# EAGLE design KMO_IO_MV5 (EAGLE 9.1.3)

## Sheet 1 of 2
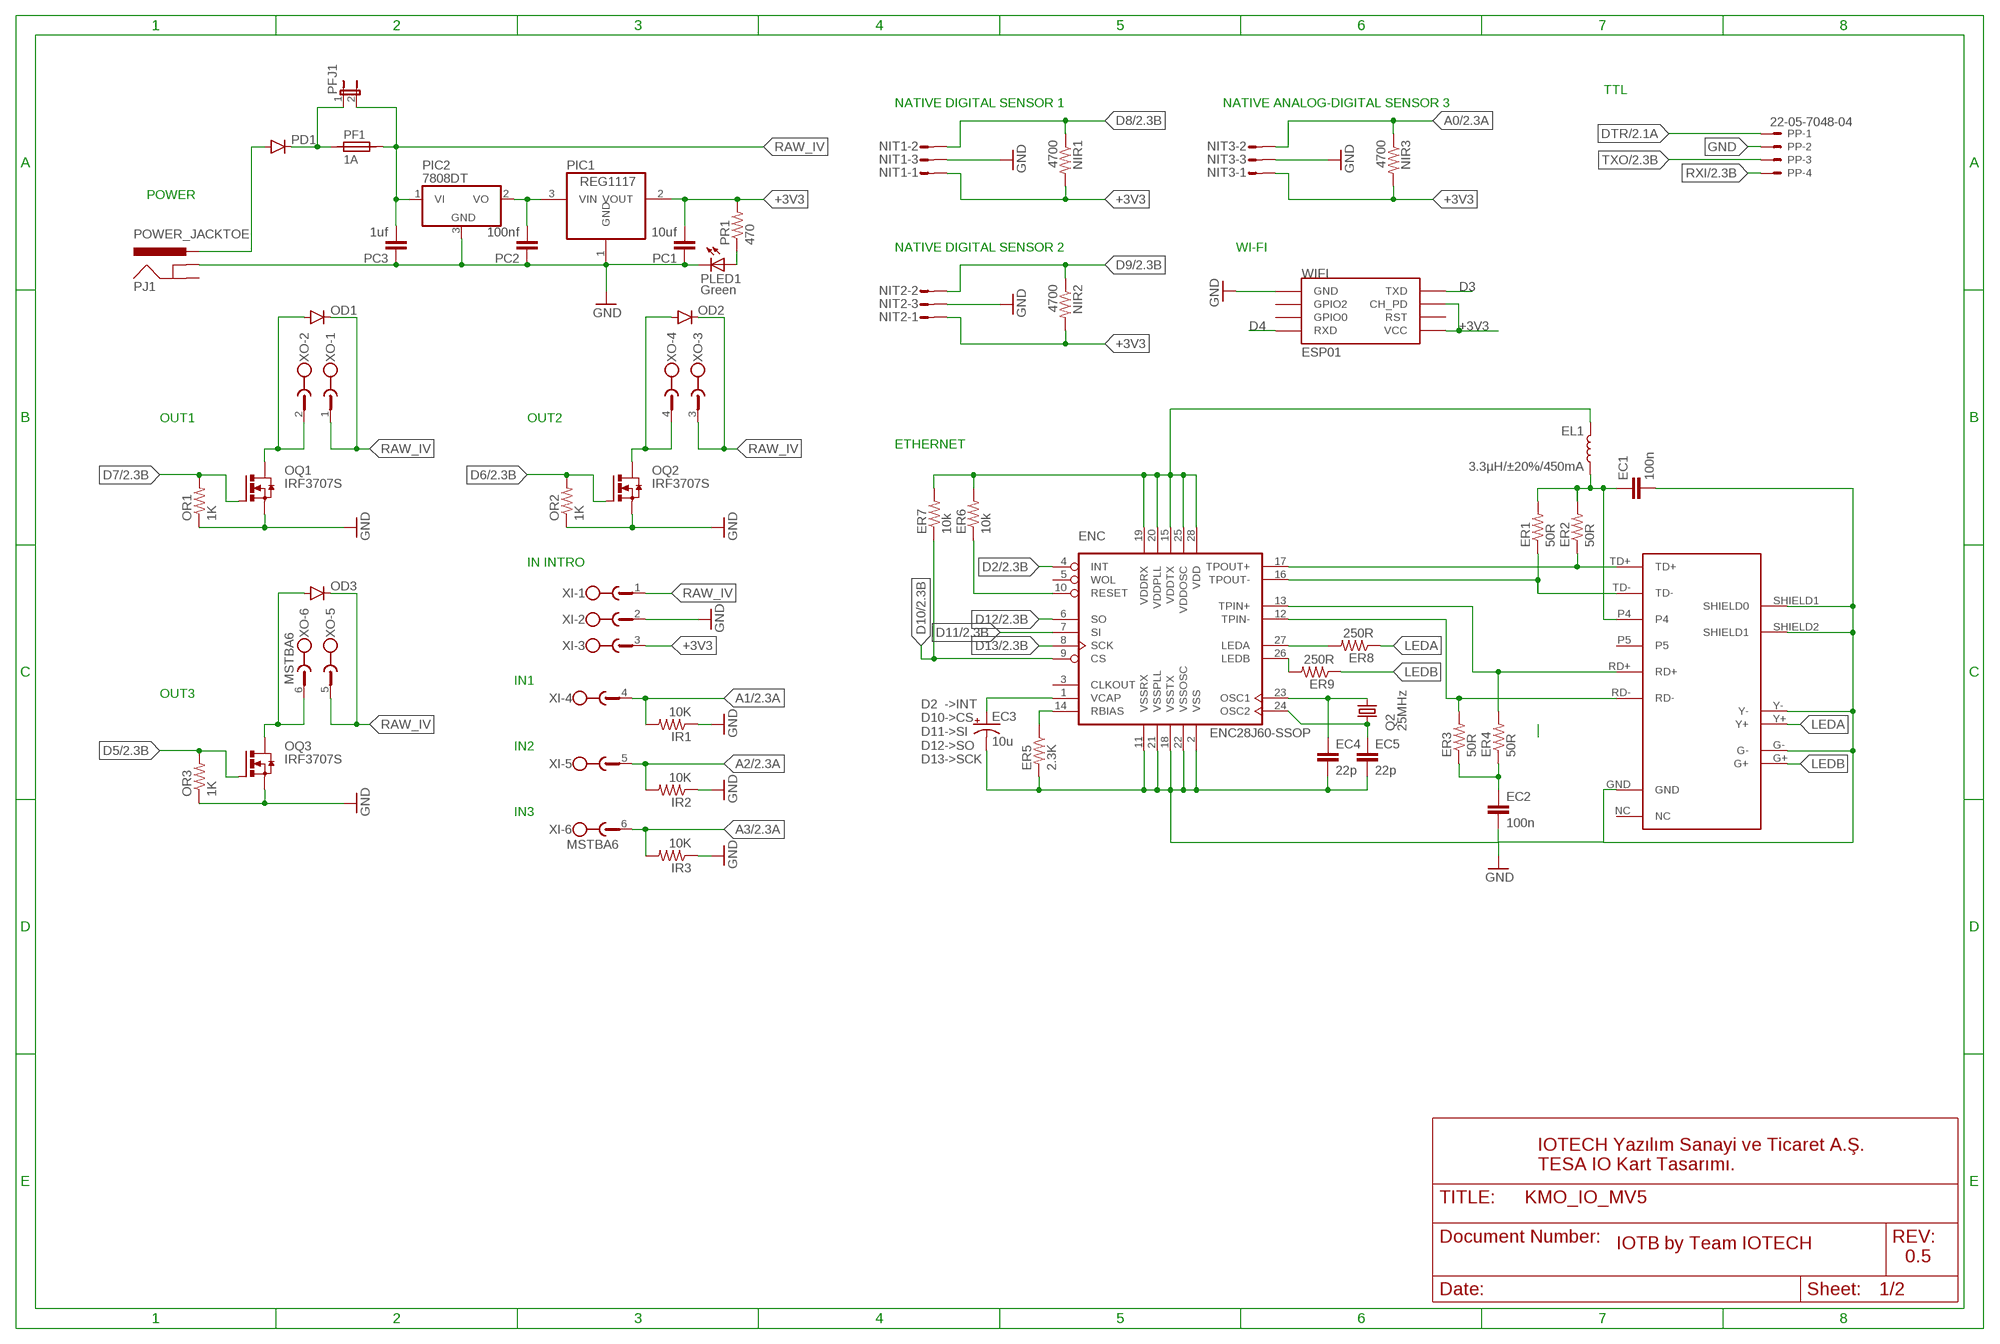
[diagram p0: schematic, sheet 1]

### Parts
EC1  100n  CAP0805  [0805]
EC2  100n  CAP0805  [0805]
EC3  10u  CAP_POL1206-KIT  [EIA3216-KIT]
EC4  22p  CAP0805  [0805]
EC5  22p  CAP0805  [0805]
EL1  3.3µH/±20%/450mA  INDUCTOR-0805-3.3UH  [0805]
ENC  ENC28J60-SSOP  [SSOP28]
ER1  50R  RESISTOR0805-RES  [0805]
ER2  50R  RESISTOR0805-RES  [0805]
ER3  50R  RESISTOR0805-RES  [0805]
ER4  50R  RESISTOR0805-RES  [0805]
ER5  2.3K  RESISTOR0805-RES  [0805]
ER6  10k  RESISTOR0805-RES  [0805]
ER7  10k  RESISTOR0805-RES  [0805]
ER8  250R  RESISTOR0805-RES  [0805]
ER9  250R  RESISTOR0805-RES  [0805]
IR1  10K  RESISTOR0805-RES  [0805]
IR2  10K  RESISTOR0805-RES  [0805]
IR3  10K  RESISTOR0805-RES  [0805]
NIR1  4700  RESISTOR0805-RES  [0805]
NIR2  4700  RESISTOR0805-RES  [0805]
NIR3  4700  RESISTOR0805-RES  [0805]
NIT1  S03P  [S03P]
NIT2  S03P  [S03P]
NIT3  S03P  [S03P]
OD1  DIODESMA  [SMA-DIODE]
OD2  DIODESMA  [SMA-DIODE]
OD3  DIODESMA  [SMA-DIODE]
OQ1  IRF3707S  IRF3704S  [D2PACK]
OQ2  IRF3707S  IRF3704S  [D2PACK]
OQ3  IRF3707S  IRF3704S  [D2PACK]
OR1  1K  RESISTOR0805-RES  [0805]
OR2  1K  RESISTOR0805-RES  [0805]
OR3  1K  RESISTOR0805-RES  [0805]
PC1  10uf  CAP0805  [0805]
PC2  100nf  CAP0805  [0805]
PC3  1uf  CAP0805  [0805]
PD1  DIODESMA  [SMA-DIODE]
PF1  1A  SIBA194600  [1820]
PFJ1  JP1E  [JP1]
PIC1  REG1117  [SOT223]
PIC2  7808DT  [TO252]
PJ1  POWER_JACKTOE  [POWER_JACK_SMD_OVERPASTE_TOE]
PLED1  Green  LEDCHIP-LED0805  [CHIP-LED0805]
PP  22-05-7048-04  [7395-04]
PR1  470  RESISTOR0805-RES  [0805]
Q2  25MHz  KX-9B  [5.0X3.2_2]
U$2  HR911105A  [RJ45]
WIFI  ESP01  [ESP01]
XI  MSTBA6  [MSTBA6]
XO  MSTBA6  [MSTBA6]

### Nets
+3V3: EL1.1 ENC.15(VDDTX) ENC.19(VDDRX) ENC.20(VDDPLL) ENC.25(VDDOSC) ENC.28(VDD) ER6.2 ER7.2 NIR1.2 NIR2.2 NIR3.2 NIT1.1 NIT2.1 NIT3.1 PC1.2 PIC1.2(VOUT) PR1.2 WIFI.CH_PD WIFI.VCC XI.3 ; also sheet 2
A0: NIR3.1 NIT3.2 ; also sheet 2
A1: IR1.2 XI.4 ; also sheet 2
A2: IR2.2 XI.5 ; also sheet 2
A3: IR3.2 XI.6 ; also sheet 2
D2: ENC.4(INT) ; also sheet 2
D3: WIFI.TX(TXD) ; also sheet 2
D4: WIFI.RX(RXD) ; also sheet 2
D5: OQ3.1(G) OR3.2 ; also sheet 2
D6: OQ2.1(G) OR2.2 ; also sheet 2
D7: OQ1.1(G) OR1.2 ; also sheet 2
D8: NIR1.1 NIT1.2 ; also sheet 2
D9: NIR2.1 NIT2.2 ; also sheet 2
D10: ENC.9(CS) ER7.1 ; also sheet 2
D11: ENC.7(SI) ; also sheet 2
D12: ENC.6(SO) ; also sheet 2
D13: ENC.8(SCK) ; also sheet 2
DTR: PP.1 ; also sheet 2
EP4: EC1.1 EL1.2 ER1.2 ER2.2 U$2.P4
GND: EC1.2 EC2.2 EC3.C(-) EC4.2 EC5.2 ENC.2(VSS) ENC.11(VSSRX) ENC.18(VSSTX) ENC.21(VSSPLL) ENC.22(VSSOSC) ER5.2 IR1.1 IR2.1 IR3.1 NIT1.3 NIT2.3 NIT3.3 OQ1.3(S) OQ2.3(S) OQ3.3(S) OR1.1 OR2.1 OR3.1 PC1.1 PC2.1 PC3.1 PIC1.1(GND) PIC2.3(GND) PJ1.GND(GNDBREAK) PLED1.C PP.2 U$2.G- U$2.GND U$2.SHIELD1(SHIELD0) U$2.SHIELD2(SHIELD1) U$2.Y- WIFI.GND XI.2 ; also sheet 2
LEDA: ER8.1 U$2.Y+
LEDB: ER9.1 U$2.G+
N$1: OD3.A OQ3.2(D) XO.6
N$2: PD1.C PF1.1 PFJ1.1
N$3: OD1.A OQ1.2(D) XO.2
N$4: OD2.A OQ2.2(D) XO.4
N$6: EC2.1 ER3.1 ER4.1
N$7: PD1.A PJ1.VIN0(PWR)
N$9: ENC.27(LEDA) ER8.2
N$11: PLED1.A PR1.1
N$12: PC2.2 PIC1.3(VIN) PIC2.2(VO)
N$13: EC3.A(+) ENC.1(VCAP)
N$14: ENC.26(LEDB) ER9.2
N$17: ENC.10(RESET) ER6.1
N$19: ENC.14(RBIAS) ER5.1
N$22: EC5.1 ENC.24(OSC2) Q2.1
N$24: EC4.1 ENC.23(OSC1) Q2.2
RAW_IV [vcc]: OD1.C OD2.C OD3.C PC3.2 PF1.2 PFJ1.2 PIC2.1(VI) XI.1 XO.1 XO.3 XO.5
RD+: ENC.13(TPIN+) ER4.2 U$2.RD+
RD-: ENC.12(TPIN-) ER3.2 U$2.RD-
RXI: PP.4 ; also sheet 2
TD+: ENC.17(TPOUT+) ER2.1 U$2.TD+
TD-: ENC.16(TPOUT-) ER1.1 U$2.TD-
TXO: PP.3 ; also sheet 2
Unconnected: ENC.3(CLKOUT) ENC.5(WOL) PJ1.P$4(GND) U$2.NC U$2.P5 WIFI.GPIO0 WIFI.GPIO2 WIFI.RST

### Notes on the sheet
- TTL
- NATIVE DIGITAL SENSOR 1 | NATIVE ANALOG-DIGITAL SENSOR 3
- POWER
- NATIVE DIGITAL SENSOR 2 | WI-FI
- OUT1 | OUT2
- ETHERNET
- IN INTRO
- IN1
- OUT3
- IN2
- D2  ->INT
  D10->CS
  D11->SI
  D12->SO
  D13->SCK
- IN3
- IOTECH Yazılım Sanayi ve Ticaret A.Ş.
  TESA IO Kart Tasarımı.
- IOTB by Team IOTECH
- 0.5

## Sheet 2 of 2
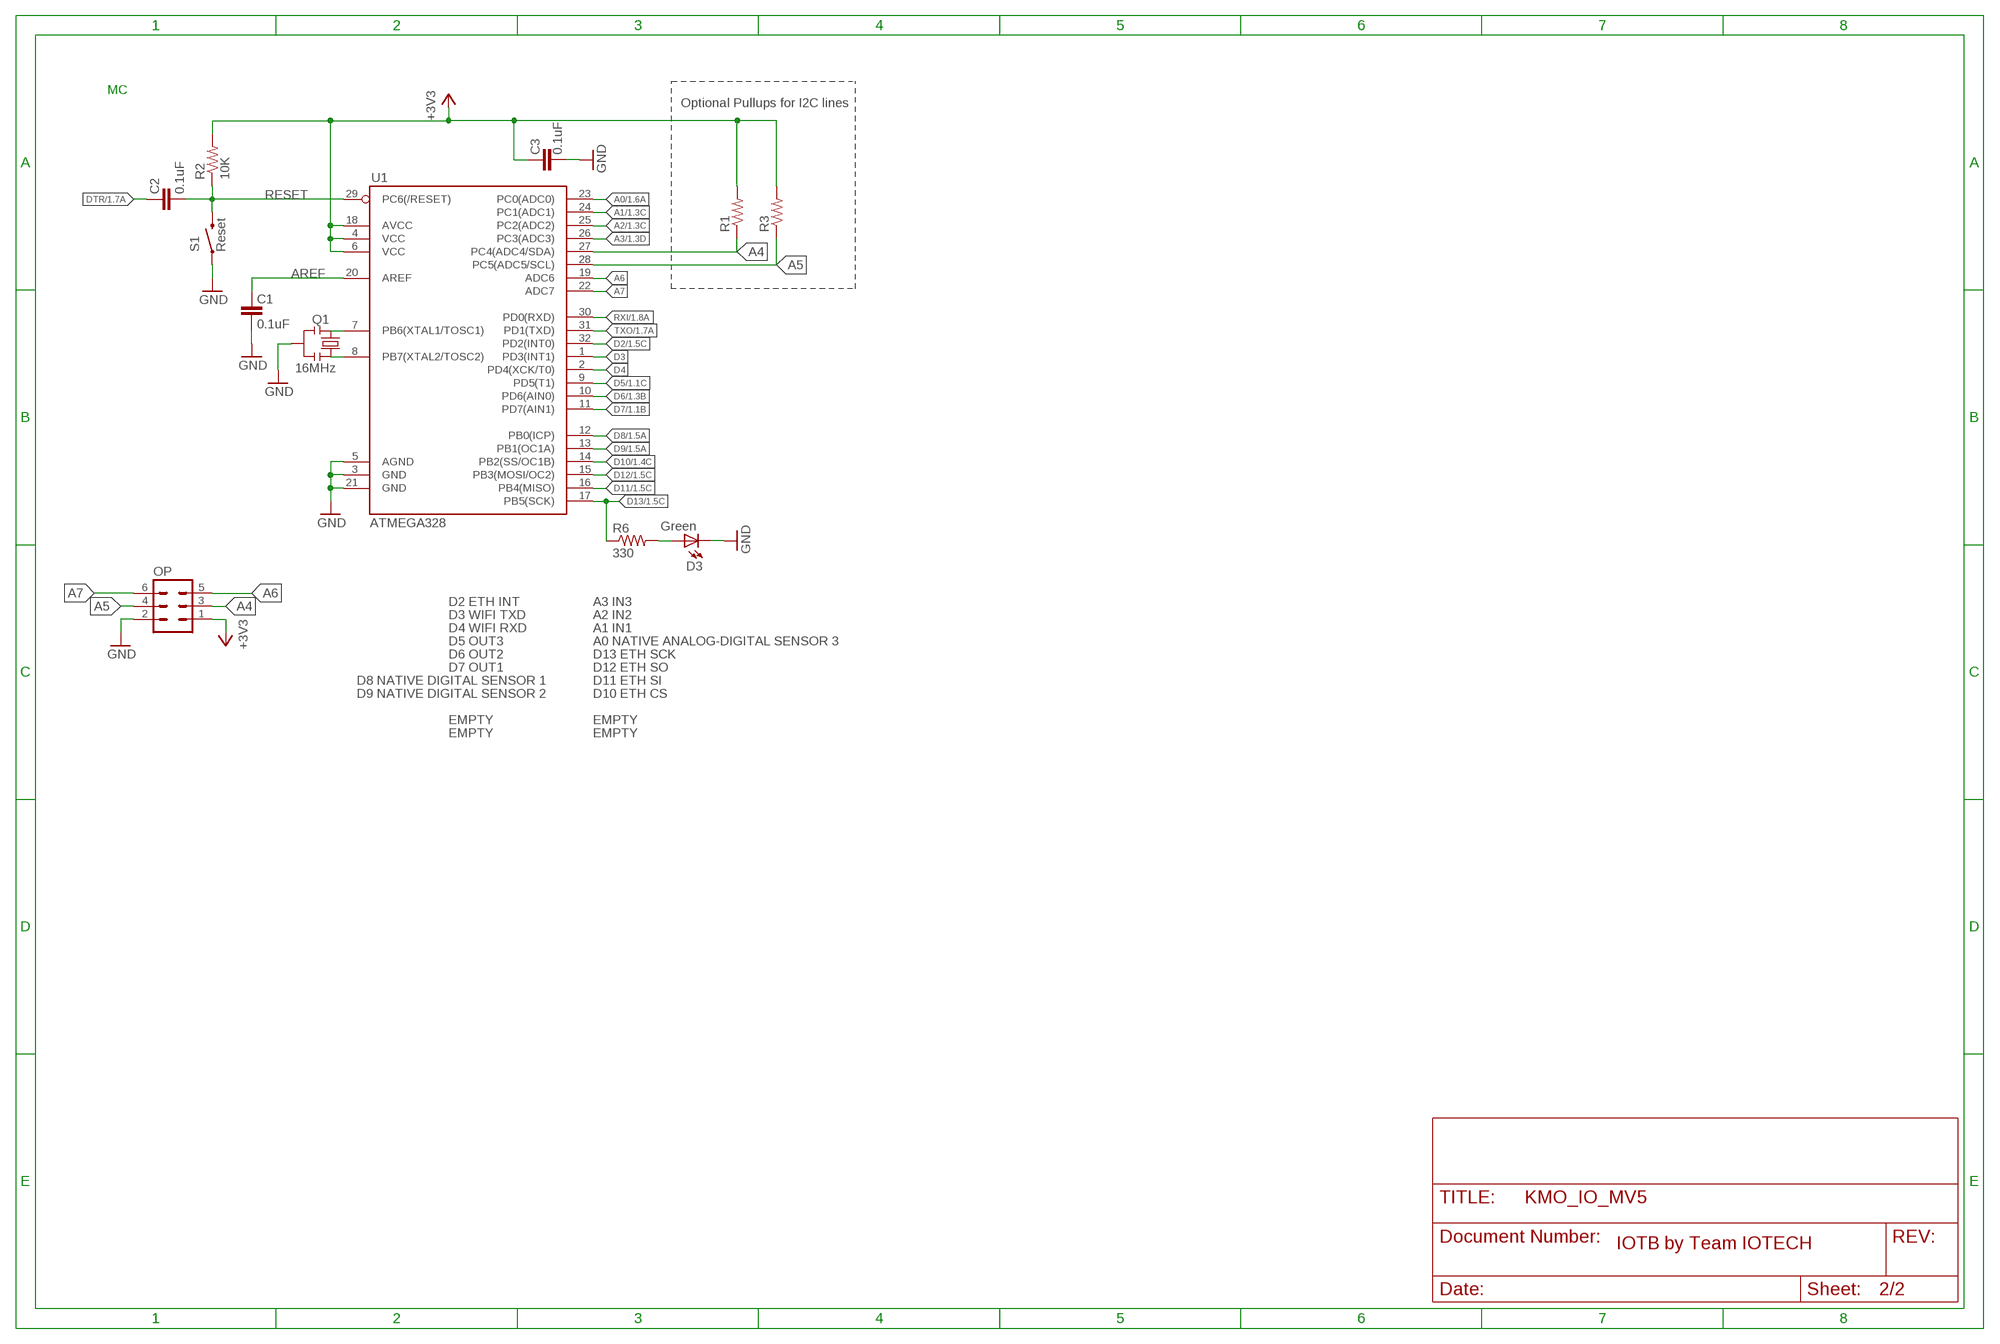
[diagram p1: schematic, sheet 2]

### Parts
C1  0.1uF  CAP0805  [0805]
C2  0.1uF  CAP0805  [0805]
C3  0.1uF  CAP0805  [0805]
D3  Green  LEDCHIP-LED0805  [CHIP-LED0805]
OP  MA03-2  [MA03-2]
Q1  16MHz  RESONATOR1:1  [RESONATOR-SMD-1:1]
R1  RESISTOR0805-RES  [0805]
R2  10K  RESISTOR0805-RES  [0805]
R3  RESISTOR0805-RES  [0805]
R6  330  RESISTOR0805-RES  [0805]
S1  Reset  SWITCH-MOMENTARY-2SMD-ALT01  [TACTILE-SWITCH-SMD-ALT01]
U1  ATMEGA328  ATMEGA168  [TQFP32-08]

### Nets
+3V3: C3.2 OP.1 R1.2 R2.2 R3.2 U1.4(VCC) U1.6(VCC) U1.18(AVCC) ; also sheet 1
A0: U1.23(PC0(ADC0)) ; also sheet 1
A1: U1.24(PC1(ADC1)) ; also sheet 1
A2: U1.25(PC2(ADC2)) ; also sheet 1
A3: U1.26(PC3(ADC3)) ; also sheet 1
A4: OP.3 R1.1 U1.27(PC4(ADC4/SDA))
A5: OP.4 R3.1 U1.28(PC5(ADC5/SCL))
A6: OP.5 U1.19(ADC6)
A7: OP.6 U1.22(ADC7)
AREF: C1.2 U1.20(AREF)
D2: U1.32(PD2(INT0)) ; also sheet 1
D3: U1.1(PD3(INT1)) ; also sheet 1
D4: U1.2(PD4(XCK/T0)) ; also sheet 1
D5: U1.9(PD5(T1)) ; also sheet 1
D6: U1.10(PD6(AIN0)) ; also sheet 1
D7: U1.11(PD7(AIN1)) ; also sheet 1
D8: U1.12(PB0(ICP)) ; also sheet 1
D9: U1.13(PB1(OC1A)) ; also sheet 1
D10: U1.14(PB2(SS/OC1B)) ; also sheet 1
D11: U1.16(PB4(MISO)) ; also sheet 1
D12: U1.15(PB3(MOSI/OC2)) ; also sheet 1
D13: R6.1 U1.17(PB5(SCK)) ; also sheet 1
DTR: C2.2 ; also sheet 1
GND: C1.1 C3.1 D3.C OP.2 Q1.2 S1.1 S1.2 U1.3(GND) U1.5(AGND) U1.21(GND) ; also sheet 1
N$5: D3.A R6.2
N$10: Q1.3 U1.8(PB7(XTAL2/TOSC2))
N$15: Q1.1 U1.7(PB6(XTAL1/TOSC1))
RESET: C2.1 R2.1 S1.3 S1.4 U1.29(PC6(/RESET))
RXI: U1.30(PD0(RXD)) ; also sheet 1
TXO: U1.31(PD1(TXD)) ; also sheet 1

### Notes on the sheet
- MC
- Optional Pullups for I2C lines
- D2 ETH INT | A3 IN3
- D3 WIFI TXD | A2 IN2
- D4 WIFI RXD | A1 IN1
- D5 OUT3 | A0 NATIVE ANALOG-DIGITAL SENSOR 3
- D6 OUT2 | D13 ETH SCK
- D7 OUT1 | D12 ETH SO
- D8 NATIVE DIGITAL SENSOR 1 | D11 ETH SI
- D9 NATIVE DIGITAL SENSOR 2 | D10 ETH CS
- EMPTY | EMPTY
- EMPTY | EMPTY
- IOTB by Team IOTECH

## Library data of the parts
C1-C3 EC1 EC2 EC4 EC5 = SparkFun-Passives:CAP: Capacitor Standard 0603 ceramic capacitor, and 0.1" leaded capacitor.
D3 PLED1 = led:LED: LED OSRAM: - CHIPLED LG R971, LG N971, LY N971, LG Q971, LY Q971, LO R971, LY R971 LH N974, LH R974 LS Q976, LO Q976, LY Q976 LO Q996 - Hyper CHIPLED LW Q18S LB Q993, LB Q99A, LB R99A - SideLED LS A670, LO A670, LY A670, LG A670, LP A670 LB A673, LV A673, LT A673, LW A673 LH A674 LY A675 LS A676, LA A676, LO A676, LY A676, LW A676 LS A679, LY A679, LG A679 - Hyper Micro SIDELED® LS Y876, LA Y876, LO Y876, LY Y876 LT Y87S - SmartLED LW L88C, LW L88S LB L89C, LB L89S, LG L890 LS L89K, LO L89K, LY L89K LS L896, LA L896, LO L896, LY L896 - TOPLED LS T670, LO T670, LY T670, LG T670, LP T670 LSG T670, LSP T670, LSY T670, LOP T670, LYG T670 LG T671, LOG T671, LSG T671 LB T673, LV T673, LT T673, LW T673 LH T674 LS T676, LA T676, LO T676, LY T676, LB T676, LH T676, LSB T676, LW T676 LB T67C, LV T67C, LT T67C, LS T67K, LO T67K, LY T67K, LW E67C LS E67B, LA E67B, LO E67B, LY E67B, LB E67C, LV E67C, LT E67C LW T67C LS T679, LY T679, LG T679 LS T770, LO T770, LY T770, LG T770, LP T770 LB T773, LV T773, LT T773, LW T773 LH T774 LS E675, LA E675, LY E675, LS T675 LS T776, LA T776, LO T776, LY T776, LB T776 LHGB T686 LT T68C, LB T68C - Hyper Mini TOPLED® LB M676 - Mini TOPLED Santana® LG M470 LS M47K, LO M47K, LY M47K Source: http://www.osram.convergy.de LUXEON: - LUMILED® LXK2-PW12-R00, LXK2-PW12-S00, LXK2-PW14-U00, LXK2-PW14-V00 LXK2-PM12-R00, LXK2-PM12-S00, LXK2-PM14-U00 LXK2-PE12-Q00, LXK2-PE12-R00, LXK2-PE12-S00, LXK2-PE14-T00, LXK2-PE14-U00 LXK2-PB12-K00, LXK2-PB12-L00, LXK2-PB12-M00, LXK2-PB14-N00, LXK2-PB14-P00, LXK2-PB14-Q00 LXK2-PR12-L00, LXK2-PR12-M00, LXK2-PR14-Q00, LXK2-PR14-R00 LXK2-PD12-Q00, LXK2-PD12-R00, LXK2-PD12-S00 LXK2-PH12-R00, LXK2-PH12-S00 LXK2-PL12-P00, LXK2-PL12-Q00, LXK2-PL12-R00 Source: www.luxeon.com KINGBRIGHT: KA-3528ASYC Source: www.kingbright.com
EC3 = SparkFun-Passives:CAP_POL: Capacitor Polarized These are standard SMD and PTH capacitors. Normally 10uF, 47uF, and 100uF in electrolytic and tantalum varieties. Always verify the external diameter of the through hole cap, it varies with capacity, voltage, and manufacturer. The EIA devices should be standard.
EL1 = SparkFun-Coils:INDUCTOR: Inductors Resist changes in electrical current. Basically a coil of wire. SparkFun Products: SparkFun Load Cell Amplifier - HX711 <https://www.sparkfun.com/products/13879> IOIO-OTG - V2.2 <https://www.sparkfun.com/products/13613>; PROD_ID: NDUC-13076
ENC = microchip-enc28j60:ENC28J60-*: Microchip 10Mbit Eth. contoller with SPI interface
ER1-ER9 IR1-IR3 NIR1-NIR3 OR1-OR3 PR1 R1-R3 R6 = SparkFun-Passives:RESISTOR: Resistor Basic schematic elements and footprints for 0603, 1206, and PTH resistors.
NIT1-NIT3 = con-amp-mt:S03P: AMP MT CONNECTOR; OC_FARNELL: unknown; OC_NEWARK: unknown
OD1-OD3 PD1 = SparkFun-DiscreteSemi:DIODE: Diode These are standard reverse protection diodes and small signal diodes. SMA package can handle up to about 1A. SOD-323 can handle about 200mA. What the SOD-323 package when ordering, there are some mfgs out there that are 5-pin packages.
OP = con-lstb:MA03-2: PIN HEADER; OC_FARNELL: unknown; OC_NEWARK: unknown
OQ1-OQ3 = transistor-power:IRF3704: SMPS MOSFET HEXFET® Power MOSFET Source: http://www.irf.com/product-info/datasheets/data/irf3704.pdf
PC1-PC3 = SparkFun-Capacitors:CAP: Capacitor Standard 0603 ceramic capacitor, and 0.1" leaded capacitor.
PF1 = _hhn_PtcFuses_Siba_r500_Ozan:SIBA194600*: SIBA PTC-Fuses, Series 194600, 1812 (4.5 3.2)mm Source: www.siba.de/ Package: SMD 1812 (4.5 x 3.2)mm Technologies: SIBA194600Axxx xxx: Trip-Current * 10 mA Author: Dipl.-Ing. FH Rainer Bayer
PFJ1 = jumper:JP1E: JUMPER
PIC1 = burr-brown:REG1117: 800mA and 1A Low Dropout (LDO) Positive Regulator 1.8V, 2.5V, 2.85V, 3.3V, 5V, and Adj; MPN: REG1117; OC_FARNELL: 1097566; OC_NEWARK: 14P6981
PIC2 = linear:78*: Positive VOLTAGE REGULATOR Source: http://cache.national.com/ds/LM/LM78L05.pdf http://www.fairchildsemi.com/ds/LM/LM7805.pdf
PJ1 = SparkFun-Connectors:POWER_JACK: Power Jack Connector This is the standard 5.5mm barrel jack for power. The PTH is the most common, proven, reliable, footprint. The Slot footprint only works if the mill layer is transmitted to the PCB fab house so be warned. Here are the connectors we sell at SparkFun: DC Barrel Power Jack/Connector <https://www.sparkfun.com/products/119> (PRT-00119) DC Barrel Power Jack/Connector (SMD) <https://www.sparkfun.com/products/12748> (PRT-12748) DC Barrel Jack Adapter - Breadboard Compatible <https://www.sparkfun.com/products/10811> (PRT-10811) It is used on this SparkFun product (and many, many others): SparkFun RedBoard - Programmed with Arduino <https://www.sparkfun.com/products/12757> (DEV-12757) Also, if you need a mating power supply or connector, please check these out: Wall Adapter Power Supply - 9VDC 650mA <https://www.sparkfun.com/products/298> (TOL-00298) DC Barrel Jack Adapter - Male <https://www.sparkfun.com/products/10287> (PRT-10287); PROD_ID: CONN-08106; SF_ID: PRT-12748
PP = con-molex:22-?-04: CONNECTOR wire to board 2.54 mm (.1 inch) pitch header; MF: MOLEX; OC_FARNELL: unknown; OC_NEWARK: unknown
Q1 = Testing:RESONATOR: Resonator Small SMD resonator. This is the itty bitty 10/20MHz resonators with built in caps. CSTCE10M0G55 and CSTCE20M0V53. Footprint for SMD has been used in SFE production for years, and does work okay. 1:1 is an attempt to get larger fillets on the sides so it will be easier to inspect these solders in our AOI machine. The pads have been minimized to match the actual metal under the resonator. To see this relation, it includes an image import of the bottom side of the component. Imported to scale on layer 200.
Q2 = crystal-geyer_V1_0:KX: Quartz Crystals (MHz) SMD: KX - Serie Model Size l/w/h [mm] Frequency Range Frequency Stability Temp. Range [°C] Load Capacitance AECQ 200 availabel Datasheet KX-4 KX-5 KX-6 KX-7 KX-9A KX-9B KX-12A KX-12B KX-13 KX-20 KX-K KX-KS 1.6/1.2/0.3 2.0/1.6/0.45 2.5/2.0/0.55 3.2/2.5/0.8 5.0/3.2/1.0 5.0/3.2/1.1 6.0/3.5/1.1 6.0/3.5/1.0 7.0/5.0 /1.3 11.6/5.5/1.6 12.3/4.5/4.2 12.3/4.5/3.2 24.0 ~ 80.0 MHz 16.0 ~ 80.0 MHz 12.0 ~ 80.0 MHz 8.0 ~ 60.0 MHz 7,68 ~ 300,0 MHz 8,0 ~ 50,0 MHz 8,0 ~ 150,0 MHz 8,0 ~ 50,0 MHz 6,0 ~ 160,0 MHz 3,579 ~ 25,0 MHz 3,579 ~ 70,0 MHz 3,579 ~ 70,0 MHz ±10 … ±50ppm ±10 … ±50ppm ±10 … ±50ppm ±10 … ±50ppm ±10 … ±50ppm ±10 … ±50ppm ±10 … ±50ppm ±10 … ±50ppm ±10 … ±50ppm ±50ppm ±10 … ±50ppm ±10 … ±50ppm (*) -40°C …+85°C (*) -40°C …+125°C (*) -40°C …+125°C (*) -40°C …+125°C (*) -40°C …+105°C (*) -40°C …+105°C (*) -40°C …+125°C (*) -40°C …+105°C (*) -40°C …+105°C (*) -40°C …+105°C (*) -40°C …+85°C (*) -40°C …+85°C 8, 8…16 8, 8…16 10, 8…16 12, 7…20 16, 10…20 16, 10…20 16, 10…20 16, 12…20 16, 12…20 16, 12…20 16, 12…30 16, 12…30 - yes yes yes - - - - - - - - KX-4.pdf <http://www.geyer-electronic.de/uploads/tx_userartikelfrequenz/GEYER-KX-4.pdf> KX-5.pdf <http://www.geyer-electronic.de/uploads/tx_userartikelfrequenz/GEYER-KX-5.pdf> KX-6.pdf <http://www.geyer-electronic.de/uploads/tx_userartikelfrequenz/GEYER-KX-6.pdf> KX-7.pdf <http://www.geyer-electronic.de/uploads/tx_userartikelfrequenz/GEYER-KX-7.pdf> KX-9A.pdf <http://www.geyer-electronic.de/uploads/tx_userartikelfrequenz/GEYER-KX-9A.pdf> KX-9B.pdf <http://www.geyer-electronic.de/uploads/tx_userartikelfrequenz/GEYER-KX-9B.pdf> KX-12A.pdf <http://www.geyer-electronic.de/uploads/tx_userartikelfrequenz/GEYER-KX-12A.pdf> KX-12B.pdf <http://www.geyer-electronic.de/uploads/tx_userartikelfrequenz/GEYER-KX-12B.pdf> KX-13.pdf <http://www.geyer-electronic.de/uploads/tx_userartikelfrequenz/GEYER-KX-13.pdf> KX-20.pdf <http://www.geyer-electronic.de/uploads/tx_userartikelfrequenz/GEYER-KX-20.pdf> KX-K.pdf <http://www.geyer-electronic.de/uploads/tx_userartikelfrequenz/GEYER-KX-K.pdf> KX-KS.pdf <http://www.geyer-electronic.de/uploads/tx_userartikelfrequenz/GEYER-KX-KS.pdf> <http://www.geyer-electronic.de/fileadmin/template/img/logo-geyer-electronic.png> Details see: http://www.geyer-electronic.de/Frequenz-Produkte.9.0.html Created 2016-06-07, Hans Locher 2016 (C) Geyer Quartz Technology KX4,KX5,KX6,KX7,KX9A,KX9B,KX12A,KX12B,KX13,KX20,KXK,KXKS;1612;2016;2520;3225;5032;6035;7050;11655;12345;1,6x1,2;2,0x1,6;2,5x2,0;3,2x2,5;5,0x3,2;6,0x3,5;7,0x5,0;11,6x5,5;12,3x4,5;12,3x4,5;1.6x1.2;2.0x1.6;2.5x2.0;3.2x2.5;5.0x3.2;6.0x3.5;7.0x5.0;11.6x5.5;12.3x4.5;12.3x4.5;
S1 = Testing:SWITCH-MOMENTARY-2: Various NO switches- pushbuttons, reed, etc
U1 = SparkFun:ATMEGA168
U$2 = HR911105A:HR911105A
WIFI = esp8266modules:ESP01: ESP8266 Wifi module 01
XI XO = con-phoenix-508:MSTBA6: PHOENIX; MF: FARNELL; MPN: 1757284; OC_FARNELL: 3705213; OC_NEWARK: 71C4165

## Net classes
0 default: width 0.203 mm, drill 0.3 mm, clearance 0.16 mm
1 vcc: width 0.254 mm, drill 0.3 mm, clearance 0.16 mm

## Board
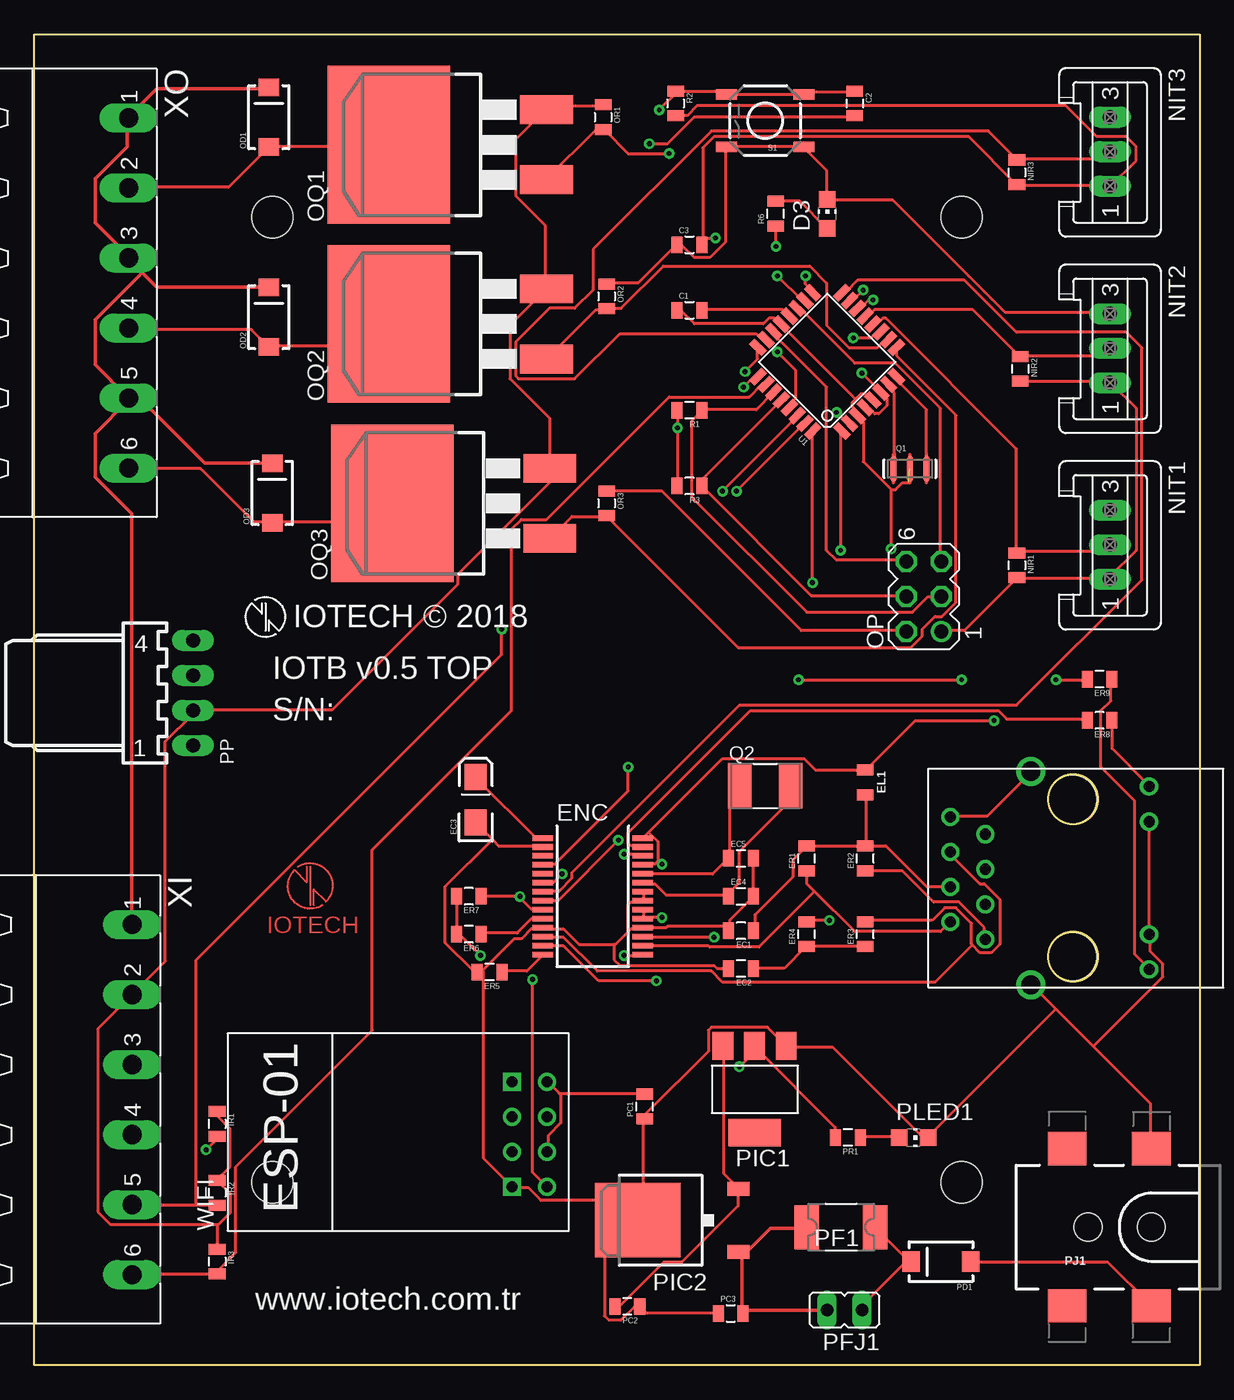
[diagram p2: board, top side]
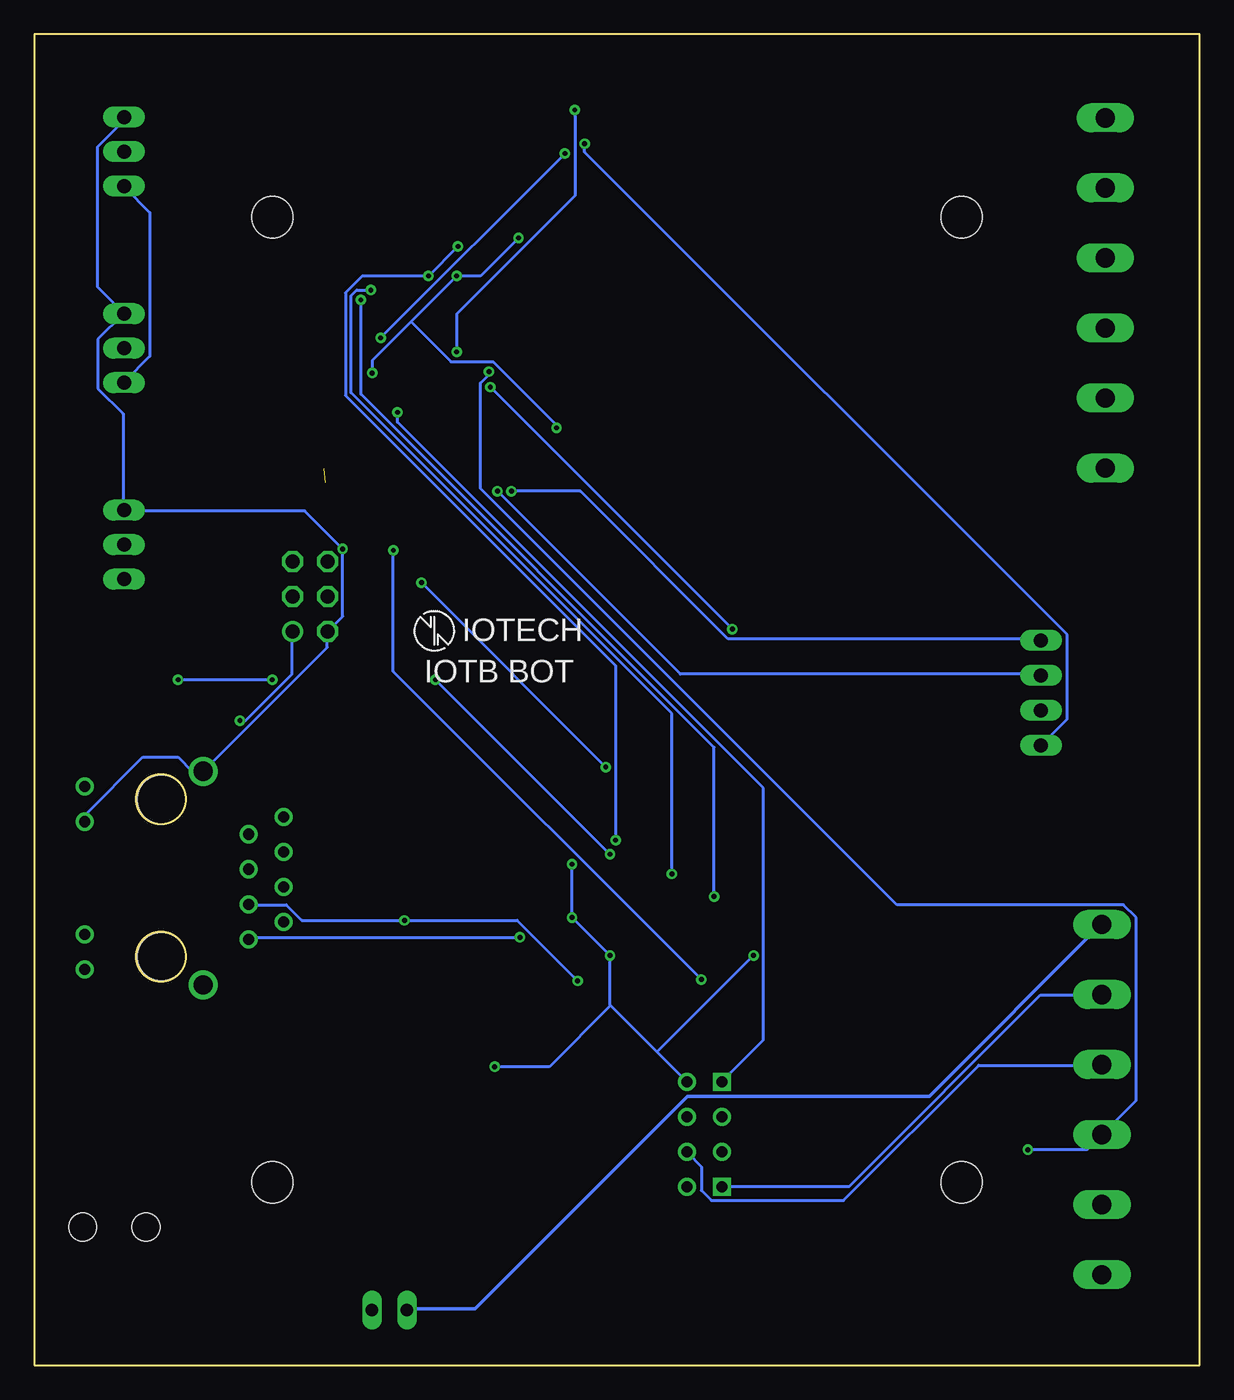
[diagram p3: board, bottom side, seen from below]

Size 84.5 x 96.5 mm. Coordinates in mm from the lower left corner, seen from the top.
Outline: 0,0 0,96.5 84.5,96.5 84.5,0 0,0
Copper layers (1*16): Top 0.035mm / dielectric 1.5mm / Bottom 0.035mm
Design rules "KMO_IO_M": minimum track width 6mil, minimum drill 0.35mm, track to track 0.205mm, track to pad 0.205mm, pad to pad 0.205mm, via to via 0.205mm, smd to smd 6mil, copper to edge 40mil, drill to drill 6mil, minimum pad ring 10mil, minimum via ring 8mil, stop-mask expansion 4mil, vias tented up to drill 0mil, thermal gap 10mil
Holes 3 mm at 17.25,83.25 67.25,83.25 17.25,13.25 67.25,13.25

### Footprints (pad centres in the part's own frame; a part is rotated, then mirrored left to right if it is on the bottom)
0805 = smd 0.8 x 1.2: 1 -0.9,0; 2 0.9,0
CHIP-LED0805 = smd 1.2 x 1.2: A 0,-1.05; C 0,1.05
EIA3216-KIT = smd 1.9 x 1.6: A 1.65,0; C -1.65,0
SSOP28 = smd 0.4 x 1.5: 1 -4.225,-3.625; 2 -3.575,-3.625; 3 -2.925,-3.625; 4 -2.275,-3.625; 5 -1.625,-3.625; 6 -0.975,-3.625; 7 -0.325,-3.625; 8 0.325,-3.625; 9 0.975,-3.625; 10 1.625,-3.625; 11 2.275,-3.625; 12 2.925,-3.625; 13 3.575,-3.625; 14 4.225,-3.625; 15 4.225,3.625; 16 3.575,3.625; 17 2.925,3.625; 18 2.275,3.625; 19 1.625,3.625; 20 0.975,3.625; 21 0.325,3.625; 22 -0.325,3.625; 23 -0.975,3.625; 24 -1.625,3.625; 25 -2.275,3.625; 26 -2.925,3.625; 27 -3.575,3.625; 28 -4.225,3.625
S03P = drill 1.016 long: 1 2.5,0; 2 0,0; 3 -2.5,0
SMA-DIODE = smd 1.27 x 1.47: A -2.15,0; C 2.15,0
MA03-2 = drill 1.016: 1 -2.54,-1.27 | drill 1.016 octagon: 2 -2.54,1.27; 3 0,-1.27; 4 0,1.27; 5 2.54,-1.27; 6 2.54,1.27
D2PACK = smd 2.083 x 3.81: 1 -2.54,-8.89; 3 2.54,-8.89 | smd 11.43 x 8.89: 2 0,2.54
1820 = smd 1.78 x 3.2: 1 -2.49,0; 2 2.49,0
JP1 = drill 0.914 long: 1 0,-1.27; 2 0,1.27
SOT223 = smd 1.499 x 2.007: 1 -2.261,-3.15; 2 0.025,-3.15; 3 2.311,-3.15 | smd 3.81 x 2.007: 4 0,3.15
TO252 = smd 1 x 1.6: 1 -2.28,-4.8; 2 2.28,-4.8 | smd 5.4 x 6.2: 3 0,2.5
POWER_JACK_SMD_OVERPASTE_TOE = smd 2.8 x 2.4: GND 0,-5.7; P$4 6.1,-5.7; VIN0 0,5.7; VIN1 6.1,5.7 | hole 2.032: 0,0; 4.572,0
7395-04 = drill 1.016 long: 1 3.81,0; 2 1.27,0; 3 -1.27,0; 4 -3.81,0
RESONATOR-SMD-1:1 = smd 0.45 x 1.905: 1 -1.2,0; 2 0,0; 3 1.2,0
5.0X3.2_2 = smd 1.7 x 3.3: 1 -1.85,0; 2 1.85,0
TACTILE-SWITCH-SMD-ALT01 = smd 1.524 x 0.762: 1 -2.794,1.905; 2 2.794,1.905; 3 -2.794,-1.905; 4 2.794,-1.905
TQFP32-08 = smd 1.27 x 0.559: 1 -4.293,2.8; 2 -4.293,2; 3 -4.293,1.2; 4 -4.293,0.4; 5 -4.293,-0.4; 6 -4.293,-1.2; 7 -4.293,-2; 8 -4.293,-2.8; 17 4.293,-2.8; 18 4.293,-2; 19 4.293,-1.2; 20 4.293,-0.4; 21 4.293,0.4; 22 4.293,1.2; 23 4.293,2; 24 4.293,2.8 | smd 0.559 x 1.27: 9 -2.8,-4.293; 10 -2,-4.293; 11 -1.2,-4.293; 12 -0.4,-4.293; 13 0.4,-4.293; 14 1.2,-4.293; 15 2,-4.293; 16 2.8,-4.293; 25 2.8,4.293; 26 2,4.293; 27 1.2,4.293; 28 0.4,4.293; 29 -0.4,4.293; 30 -1.2,4.293; 31 -2,4.293; 32 -2.8,4.293
RJ45 = drill 0.8: G+ 5.84,-6.305; G- 5.84,-3.765; GND -8.57,4.76; NC -6.03,3.5; P4 -8.57,-0.32; P5 -6.03,0.96; RD+ -6.03,-1.58; RD- -8.57,2.22; TD+ -6.03,-4.12; TD- -8.57,-2.86; Y+ 5.84,6.945; Y- 5.84,4.405 | drill 1.4: SHIELD1 -2.73,-7.425; SHIELD2 -2.73,8.065 | hole 3.5: 0.3,-5.38; 0.3,6.02
ESP01 = drill 0.8: CH_PD -1.285,-8.178; GPIO0 1.255,-5.638; GPIO2 -1.285,-5.638; RST 1.255,-8.178; TX -3.825,-8.178; VCC 3.795,-8.178 | drill 0.8 square: GND -3.825,-5.638; RX 3.795,-5.638
MSTBA6 = drill 1.397 long: 1 -12.7,5.08; 2 -7.62,5.08; 3 -2.54,5.08; 4 2.54,5.08; 5 7.62,5.08; 6 12.7,5.08

### Placement (x,y rotation side)
C1  47.5,76.5 0 top
C2  59.5,91.5 270 top
C3  47.5,81.25 0 top
D3  57.5,83.5 0 top
EC1  51.25,31.5 180 top
EC2  51.25,28.75 180 top
EC3  32,41 90 top
EC4  51.25,34 0 top
EC5  51.25,36.75 0 top
EL1  60.25,42.25 270 top
ENC  40.5,34 270 top
ER1  56,36.75 90 top
ER2  60.25,36.75 90 top
ER3  60.25,31.25 90 top
ER4  56,31.25 90 top
ER5  33,28.5 180 top
ER6  31.5,31.25 180 top
ER7  31.5,34 180 top
ER8  77.25,46.75 180 top
ER9  77.25,49.75 180 top
IR1  13.25,17.5 270 top
IR2  13.25,12.5 270 top
IR3  13.25,7.5 270 top
NIR1  71.25,58 270 top
NIR2  71.5,72.25 270 top
NIR3  71.25,86.5 270 top
NIT1  78,59.5 270 top
NIT2  78,73.75 270 top
NIT3  78,88 270 top
OD1  17,90.5 90 top
OD2  17,76 90 top
OD3  17.25,63.25 90 top
OP  64.5,55.75 90 top
OQ1  28.25,88.5 90 top
OQ2  28.25,75.5 90 top
OQ3  28.5,62.5 90 top
OR1  41.25,90.5 270 top
OR2  41.5,77.5 270 top
OR3  41.5,62.5 270 top
PC1  44.25,18.75 90 top
PC2  43,4.25 180 top
PC3  50.5,3.75 0 top
PD1  65.75,7.5 180 top
PF1  58.5,10 180 top
PFJ1  58.75,4 90 top
PIC1  52.25,20 180 top
PIC2  46.25,10.5 90 top
PJ1  81,10 180 top
PLED1  63.75,16.5 270 top
PP  11.5,48.75 270 top
PR1  59,16.5 180 top
Q1  63.5,65 0 top
Q2  53,42 0 top
R1  47.5,69.25 180 top
R2  46.5,91.5 270 top
R3  47.5,63.75 180 top
R6  53.75,83.5 90 top
S1  53,90.25 180 top
U1  57.5,72.75 135 top
U$1  [IOTECH_COPPER_W_TEXT]  20,34.75 0 top
U$2  75,35 0 top
WIFI  29,16.75 90 top
XI  2,19.25 270 top
XO  1.75,77.75 270 top

### Tracks (layer width: path | path; a pad name or v marks a point on that pad's centre or on a via)
+3V3  (via drill 0.35)
  Top 0.203: R3.2 46.64,63.78 v46.64,67.97 46.64,69.19 R1.2 | U1.4 60.31,69.39 60.52,69.39 60.92,68.99 61.23,68.99 61.84,69.6 61.84,70.11 61.43,70.52 U1.6 61.33,70.62 v60.01,71.94 | 48.47,81.74 48.47,88.27 49.29,89.09 67.76,89.09 71.23,85.62 NIR3.2 71.33,85.52 77.97,85.52 NIT3.1 78.07,85.52 79.91,87.36 79.91,88.38 79.19,89.09 77.05,89.09 74.8,91.33 48.07,91.33 47.35,90.62 46.53,90.62 R2.2 | 48.47,81.74 48.47,81.33 C3.2 48.47,81.74 | v53.88,78.99 55.62,77.25 55.82,77.25 U1.18 | 48.47,81.74 v49.39,81.74 | OP.1 65.82,53.27 67.45,53.27 71.23,57.05 NIR1.2 71.33,57.05 77.97,57.05 NIT1.1 77.97,57.15 79.91,59.09 79.91,69.39 78.07,71.23 NIT2.1 77.97,71.33 71.54,71.33 NIR2.2 | 44.55,38.63 44.19,38.27 ENC.28 | 44.55,38.63 49.9,43.98 55.82,43.98 56.64,43.17 60.21,43.17 EL1.1 60.31,43.17 63.88,46.74 v69.6,46.74 | 45.16,36.48 45.21,36.53 45.21,37.96 44.55,38.63 | 45.16,36.48 45,36.33 44.19,36.33 ENC.25 | PR1.2 58.07,16.53 58.07,17.25 52.25,23.06 PIC1.2 52.35,22.86 v51.13,21.64 | ER7.2 30.61,33.98 30.61,31.33 ER6.2 30.72,31.33 v32.35,29.7 | ENC.20 44.19,32.96 44.19,32.45 ENC.19 44.29,32.45 v45.51,32.45 | 38.17,19.7 38.06,19.7 37.25,20.51 WIFI.VCC | 38.17,19.7 44.19,19.7 PC1.2 | v42.76,29.7 44.09,29.7 ENC.15 | 38.17,19.7 38.17,17.55 37.25,16.63 37.25,15.51 WIFI.CH_PD | v45.51,36.33 45.41,36.43 45.21,36.43 45.16,36.48
  Bottom 0.203: v49.39,81.74 52.15,78.99 v53.88,78.99 57.2,75.67 | v60.01,71.94 60.01,72.86 57.2,75.67 | v46.64,67.97 46.64,68.17 51.23,72.76 54.29,72.76 57.2,75.67 | NIT2.1 77.97,71.33 76.13,73.17 76.13,83.58 77.97,85.42 NIT3.1 | 39.34,22.71 37.25,20.61 WIFI.VCC | 39.34,22.71 42.71,26.07 | 42.71,26.07 42.76,26.12 v42.76,29.7 v45.51,32.45 v45.51,36.33 | 39.34,22.71 v32.35,29.7 | XI.3 7.14,21.74 16.02,21.74 25.82,11.94 35.41,11.94 36.13,12.65 36.13,14.39 37.15,15.41 WIFI.CH_PD | v51.13,21.64 47.15,21.64 42.71,26.07 | v69.6,46.74 69.19,46.74 65.82,50.11 65.82,53.17 OP.1
A0
  Top 0.203: NIT3.2 77.97,87.97 77.46,87.46 71.33,87.46 NIR3.1 71.23,87.46 69.19,89.5 49.09,89.5 40.51,80.93 40.51,77.97 39.19,76.64 37.35,76.64 34.9,74.19 34.9,71.74 35.1,71.54 39.19,71.54 42.45,74.8 52.35,74.8 52.76,74.39 52.96,74.39 U1.23
A1  (via drill 0.35)
  Top 0.203: v12.45,15.61 13.16,16.33 13.16,16.53 IR1.2 | v51.53,72.05 52.45,72.97 52.45,73.78 U1.24
  Bottom 0.203: v12.45,15.61 8.16,15.61 7.14,16.63 XI.4 7.04,16.74 4.59,19.18 4.59,32.45 5.51,33.37 21.94,33.37 52.15,63.58 52.15,71.23 51.53,71.84 v51.53,72.05
A2  (via drill 0.35)
  Top 0.203: 11.74,11.63 7.14,11.63 XI.5 | 11.74,11.63 13.16,11.63 IR2.2 | v51.43,70.92 52.15,71.64 52.45,71.64 U1.25 | v33.88,53.37 33.88,51.53 11.74,29.39 11.74,11.63
  Bottom 0.203: v33.88,53.37 v51.43,70.92
A3
  Top 0.203: XI.6 7.14,6.63 13.16,6.63 IR3.2 13.16,6.74 14.59,8.16 14.59,14.39 24.49,24.29 24.49,37.35 34.59,47.45 34.59,60.62 35.31,61.33 37.15,61.33 46.02,70.21 51.84,70.21 52.76,71.13 52.96,71.13 U1.26
A4
  Top 0.203: U1.27 53.58,70.52 52.35,69.29 48.47,69.29 R1.1 48.37,69.19 47.66,68.48 47.66,62.97 56.02,54.6 63.68,54.6 64.8,55.72 65.72,55.72 OP.3
A5
  Top 0.203: U1.28 54.09,69.9 48.47,64.29 48.47,63.78 R3.1 48.47,63.68 56.33,55.82 63.17,55.82 OP.4
A6
  Top 0.203: U1.19 55.41,76.54 55.62,76.54 59.49,72.66 62.45,72.66 65.72,69.39 65.72,58.37 OP.5
A7
  Top 0.203: U1.22 53.68,74.91 53.68,74.7 57.45,70.92 57.45,59.09 58.17,58.37 63.17,58.37 OP.6
AREF
  Top 0.203: C1.2 48.47,76.54 54.29,76.54 54.7,76.13 U1.20
D2  (via drill 0.35)
  Top 0.203: v56.43,56.74 56.43,67.66 U1.32 | v43.06,43.37 43.06,41.64 37.76,36.33 36.94,36.33 ENC.4
  Bottom 0.203: v43.06,43.37 v56.43,56.74
D3  (via drill 0.35)
  Top 0.203: v58.48,59.09 58.48,67.66 U1.1 | v36.13,27.96 36.13,13.98 37.15,12.96 WIFI.TX
  Bottom 0.203: v58.48,59.09 58.48,50.31 v36.13,27.96
D4  (via drill 0.35)
  Top 0.203: v58.17,69.09 58.88,68.37 59.09,68.37 U1.2
  Bottom 0.203: v58.17,69.09 58.17,68.37 31.64,41.84 31.64,23.57 34.59,20.61 WIFI.RX
D5
  Top 0.203: OQ3.1 37.45,60.01 38.98,61.54 41.43,61.54 OR3.2 41.53,61.54 51.02,52.05 63.58,52.05 64.39,52.86 64.39,53.37 65.31,54.29 65.82,54.29 66.84,55.31 66.84,68.88 62.56,73.17 62.56,73.78 U1.9
D6
  Top 0.203: OQ2.1 40.72,76.54 41.43,76.54 OR2.2 41.53,76.64 42.55,76.64 45.62,79.7 56.23,79.7 57.45,78.48 57.45,75.42 59.09,73.78 61.13,73.78 61.64,74.29 61.94,74.29 U1.10
D7  (via drill 0.35)
  Top 0.203: OQ1.1 37.15,86.03 40.72,89.6 41.23,89.6 OR1.2 41.33,89.6 43.06,87.86 v46.02,87.86 | v59.39,74.5 60.72,74.5 61.13,74.91 61.33,74.91 U1.11
  Bottom 0.203: v46.02,87.86 v59.39,74.5
D8
  Top 0.203: NIT1.2 77.97,59.49 77.46,58.98 71.33,58.98 NIR1.1 71.23,58.98 71.23,66.44 61.74,75.92 61.54,75.92 61.13,75.52 60.82,75.52 U1.12
D9
  Top 0.203: NIT2.2 77.97,73.68 77.46,73.17 71.54,73.17 NIR2.1 71.44,73.17 68.07,76.54 60.92,76.54 60.52,76.13 60.31,76.13 U1.13
D10  (via drill 0.35)
  Top 0.203: 35.16,33.93 36.02,33.06 36.84,33.06 ENC.9 | 35.16,33.93 35.1,33.98 32.45,33.98 ER7.1 | v60.82,77.25 60.52,77.25 59.9,76.64 U1.14 | v35.21,33.98 35.16,33.93
  Bottom 0.203: v60.82,77.25 60.82,70.42 35.21,44.8 v35.21,33.98
D11
  Top 0.203: U1.16 58.58,77.86 58.88,77.86 59.7,78.68 67.45,78.68 71.23,74.91 79.19,74.91 80.31,73.78 80.31,56.94 71.23,47.86 51.13,47.86 38.98,35.72 38.98,35.31 38.06,34.39 36.94,34.39 ENC.7
D12  (via drill 0.35)
  Top 0.203: v60.11,77.97 59.39,77.25 59.19,77.25 U1.15 | v38.27,35.62 37.66,35 36.94,35 ENC.6
  Bottom 0.203: v60.11,77.97 61.13,77.97 61.54,77.56 61.54,70.52 38.27,47.25 v38.27,35.62
D13  (via drill 0.35)
  Top 0.203: v53.78,81.13 53.78,82.56 R6.1 | v55.92,78.99 55.92,78.37 56.43,77.86 U1.17 | v42.35,38.06 37.96,33.68 36.94,33.68 ENC.8
  Bottom 0.203: v53.78,81.13 v55.92,78.99 60.72,78.99 61.94,77.76 61.94,70.31 42.35,50.72 v42.35,38.06
DTR  (via drill 0.35)
  Top 0.203: v44.6,88.58 45.92,88.58 47.86,90.52 59.49,90.52 C2.2
  Bottom 0.203: v44.6,88.58 44.6,87.97 9.59,52.96 9.59,46.84 11.43,45 PP.1
EP4
  Top 0.203: ER2.2 60.31,37.66 60.31,41.33 EL1.2 | EC1.1 52.25,31.53 52.25,32.66 55.01,35.41 55.01,36.64 55.92,37.55 ER1.2 56.02,37.66 60.21,37.66 ER2.2 | U$2.P4 66.33,34.7 64.7,34.7 61.74,37.66 60.41,37.66 ER2.2
GND  (via drill 0.35)  (1 unrouted)
  Top 0.203: OR1.1 41.23,91.33 37.35,91.33 37.15,91.13 OQ1.3 37.04,91.03 34.9,88.89 34.9,84.8 37.04,82.66 37.04,78.07 OQ2.3 37.04,77.97 34.49,75.42 34.49,71.54 37.35,68.68 37.35,65.11 OQ3.3 37.35,65.01 37.35,63.98 30.72,57.35 30.72,56.64 21.64,47.55 11.53,47.55 PP.2 11.43,47.45 11.43,47.15 9.49,45.21 9.49,29.29 7.14,26.94 XI.2 7.04,26.84 4.59,24.39 4.59,11.12 5.51,10.21 13.27,10.21 13.32,10.15 | 13.32,10.15 14.19,11.02 14.19,12.45 13.27,13.37 IR2.1 13.27,13.47 14.19,14.39 14.19,17.14 13.27,18.06 13.27,18.37 IR1.1 | 13.32,10.15 13.27,10.1 13.27,8.47 IR3.1 | OR2.1 41.53,78.48 43.78,78.48 46.53,81.23 C3.1 46.64,81.23 46.94,81.23 47.86,80.31 48.98,80.31 50.11,81.44 50.11,88.27 S1.2 50.21,88.38 55.72,88.38 S1.1 55.82,88.27 57.45,86.64 57.45,84.6 D3.C 57.56,84.5 62.25,84.5 70.42,76.33 77.97,76.33 NIT2.3 | C1.1 46.64,76.44 46.94,76.44 47.86,75.52 52.86,75.52 53.27,75.92 53.68,75.92 54.09,75.52 U1.21 54.19,75.42 59.55,70.06 | 59.55,70.06 59.9,70.42 60.31,70.42 60.72,70.01 U1.5 | 59.55,70.06 59.29,69.8 59.29,69.5 59.6,69.19 59.6,68.88 U1.3 59.7,68.78 60.11,68.37 60.11,65.52 62.15,63.48 | 62.15,63.48 62.45,63.48 62.97,63.98 63.37,63.98 63.5,63.98 | OR3.1 41.53,63.37 45.51,63.37 55.62,53.27 63.17,53.27 OP.2 | v62.15,59.19 62.15,63.48 | 50.41,31.84 50.41,32.25 52.15,33.98 EC4.2 52.15,34.09 52.15,36.74 EC5.2 | 50.41,31.84 50.41,31.53 EC1.2 50.41,31.84 | ENC.22 44.19,34.29 44.19,33.68 ENC.21 44.09,33.57 43.27,33.57 43.06,33.37 43.06,31.53 43.12,31.48 | 43.12,31.48 43.27,31.64 44.09,31.64 ENC.18 44.19,31.74 45.82,31.74 45.92,31.84 50.41,31.84
  Top 0.203: 43.12,31.48 42.1,30.46 | 42.1,30.46 42.05,30.41 42.05,29.39 42.45,28.98 49.29,28.98 49.49,28.78 50.31,28.78 EC2.2 | 33.22,38.12 32.04,39.29 EC3.C | 33.22,38.12 33.68,37.66 36.84,37.66 ENC.2 | 32.5,28.62 34.8,30.92 35.31,30.92 36.02,31.64 36.84,31.64 ENC.11 36.94,31.64 38.37,31.64 39.49,30.51 42.05,30.51 42.1,30.46 | 32.5,28.62 32.45,28.57 32.15,28.57 ER5.2 32.04,28.57 31.84,28.57 29.8,30.61 29.8,34.7 33.22,38.12 | PC3.1 49.6,3.78 44.39,3.78 43.98,4.18 PC2.1 43.88,4.18 43.47,4.18 42.55,3.27 41.64,3.27 41.33,3.57 41.33,8.06 43.68,10.41 PIC2.3 | 44.19,11.94 44.19,10.92 43.78,10.51 PIC2.3 | 44.19,11.94 44.19,17.76 PC1.1 44.29,17.86 44.29,18.16 48.88,22.76 48.88,24.29 49.09,24.49 53.17,24.49 54.49,23.16 PIC1.1 54.6,23.06 57.86,23.06 64.39,16.53 64.7,16.53 PLED1.C 64.8,16.53 74.09,25.82 | 44.19,11.94 36.74,11.94 35.82,12.86 34.7,12.86 WIFI.GND 34.59,12.96 32.55,15 32.55,28.57 32.5,28.62 | 44.19,11.94 PIC2.3 | U$2.GND 66.44,39.8 69.09,39.8 72.25,42.96 U$2.SHIELD2 | U$2.Y- 80.82,39.39 80.82,31.33 U$2.G- 80.93,31.23 80.93,30 81.84,29.08 81.84,28.17 76.79,23.11 | 74.09,25.82 72.35,27.55 U$2.SHIELD1 | 74.09,25.82 76.79,23.11 | 76.79,23.11 80.93,18.98 80.93,15.72 PJ1.GND
  Bottom 0.203: NIT3.3 78.07,90.42 78.07,90.21 79.91,88.38 79.91,78.17 78.07,76.33 NIT2.3 78.07,76.23 79.91,74.39 79.91,70.82 78.07,68.99 78.07,62.05 NIT1.3 77.97,61.94 64.9,61.94 v62.15,59.19 62.15,54.29 63.17,53.27 OP.2 63.27,53.17 63.27,52.05 72.25,43.06 U$2.SHIELD2 72.35,43.06 73.07,43.06 74.09,44.09 76.64,44.09 80.82,39.9 80.82,39.49 U$2.Y- | XI.2 7.14,26.84 11.53,26.84 25.41,12.96 34.59,12.96 WIFI.GND
LEDA
  Top 0.203: ER8.1 78.17,46.74 78.17,44.7 80.82,42.05 U$2.Y+
LEDB
  Top 0.203: ER9.1 78.07,49.7 78.07,48.17 77.35,47.45 77.35,43.37 79.8,40.92 79.8,29.8 80.82,28.78 U$2.G+
N$1
  Top 0.203: OQ3.2 25.92,62.45 24.59,61.13 17.35,61.13 OD3.A 17.25,61.13 15.92,61.13 12.04,65.01 6.84,65.01 XO.6
N$2
  Top 0.203: PF1.1 61.03,9.9 63.37,7.55 63.58,7.55 PD1.C 63.27,7.55 60.11,4.39 60.11,4.08 PFJ1.1
N$3
  Top 0.203: OQ1.2 25.61,88.48 25.51,88.38 17.04,88.38 OD1.A 16.94,88.27 14.08,85.42 6.84,85.42 XO.2
N$4
  Top 0.203: OQ2.2 25.61,75.42 24.08,73.88 17.04,73.88 OD2.A 16.94,73.88 15.72,75.11 6.84,75.11 XO.4
N$5
  Top 0.203: R6.2 53.78,84.39 55.52,84.39 57.45,82.46 D3.A
N$6
  Top 0.203: EC2.1 52.25,28.78 54.39,28.78 55.92,30.31 ER4.1 56.02,30.41 60.21,30.41 ER3.1
N$7
  Top 0.203: PD1.A 67.97,7.45 77.86,7.45 80.93,4.39 PJ1.VIN0
N$9
  Top 0.203: ER8.2 76.33,46.84 70.52,46.84 69.9,47.45 51.94,47.45 43.06,38.58 43.06,37.86 43.27,37.66 44.09,37.66 ENC.27
N$10
  Top 0.203: U1.8 62.56,71.64 62.56,71.44 64.7,69.29 64.7,66.13 Q1.3
N$11
  Top 0.203: PR1.1 59.9,16.53 62.66,16.53 PLED1.A
N$12
  Top 0.203: PC2.2 42.15,4.29 42.45,4.29 45.62,7.45 46.94,7.45 51.02,11.53 51.02,12.76 PIC2.2 51.02,12.86 50.01,13.88 50.01,23.06 PIC1.3
N$13
  Top 0.203: ENC.1 36.84,38.27 36.33,38.27 32.04,42.55 EC3.A
N$14  (via drill 0.35)
  Top 0.203: v74.09,49.7 76.33,49.7 ER9.2 | v55.41,49.7 v67.25,49.7 | v42.76,37.04 43.98,37.04 44.09,36.94 ENC.26
  Bottom 0.203: v67.25,49.7 v74.09,49.7 | v42.76,37.04 v55.41,49.7
N$15
  Top 0.203: U1.7 62.05,71.13 62.05,70.82 62.35,70.52 62.35,66.13 Q1.1
N$17
  Top 0.203: ER6.1 32.45,31.33 35,31.33 36.02,32.35 36.84,32.35 ENC.10
N$19
  Top 0.203: ER5.1 33.98,28.57 35.72,28.57 36.84,29.7 ENC.14
N$22
  Top 0.203: Q2.1 51.13,41.94 50.41,41.23 50.41,36.84 EC5.1 50.31,36.74 49.19,35.62 44.19,35.62 ENC.24
N$24
  Top 0.203: ENC.23 44.19,34.9 45,34.9 45.82,34.09 50.31,34.09 EC4.1 50.31,34.19 51.13,35 51.13,37.25 54.8,40.92 54.8,41.94 Q2.2
RAW_IV
  Top 0.254: OD1.C 16.94,92.56 8.88,92.56 6.84,90.52 XO.1 6.74,90.42 6.74,88.38 4.39,86.03 4.39,82.86 6.84,80.42 XO.3 6.84,80.21 7.81,79.24 | 7.81,79.24 8.88,78.17 16.94,78.17 OD2.C | PFJ1.2 57.45,3.98 51.43,3.98 PC3.2 51.33,3.78 51.33,7.96 51.13,8.16 PIC2.1 51.43,7.96 53.37,9.9 55.92,9.9 PF1.2 | OD3.C 17.25,65.41 12.35,65.41 7.65,70.11 6.84,70.11 XO.5 | XI.1 7.04,32.04 7.04,61.74 4.39,64.39 4.39,67.56 6.84,70.01 XO.5 | 7.81,79.24 4.39,75.82 4.39,72.56 6.74,70.21 XO.5
  Bottom 0.254: PFJ1.2 57.45,4.08 52.56,4.08 37.15,19.49 19.59,19.49 7.14,31.94 XI.1
RD+  (via drill 0.35)
  Top 0.203: v57.66,32.25 56.02,32.25 ER4.2 | v45.11,27.86 40.92,27.86 38.37,30.41 36.94,30.41 ENC.13
  Bottom 0.203: U$2.RD+ 68.88,33.37 66.23,33.37 65.11,32.25 v57.66,32.25 49.49,32.25 v45.11,27.86
RD-
  Top 0.203: 68.02,30.46 68.58,29.9 69.39,29.9 70.01,30.51 70.01,33.78 68.88,34.9 68.58,34.9 66.33,37.15 U$2.RD- | 68.02,30.46 67.97,30.51 67.97,32.04 66.84,33.17 66.03,33.17 65.11,32.25 60.31,32.25 ER3.2 | 68.02,30.46 65.31,27.76 49.9,27.76 49.09,28.57 40.82,28.57 38.37,31.02 36.94,31.02 ENC.12
RESET  (via drill 0.35)
  Top 0.203: C2.1 59.49,92.36 55.92,92.36 55.82,92.25 S1.3 55.72,92.15 S1.4 50.11,92.25 50.01,92.36 46.53,92.36 R2.1 46.53,92.25 v45.31,91.03 | v53.88,73.48 55.21,72.15 55.21,70.11 54.8,69.7 54.8,69.5 U1.29
  Bottom 0.203: v53.88,73.48 53.88,76.23 45.31,84.8 v45.31,91.03
RXI  (via drill 0.35)
  Top 0.203: v49.9,63.37 55.31,68.78 U1.30
  Bottom 0.203: v49.9,63.37 44.9,63.37 34.19,52.66 11.53,52.66 PP.4
TD+  (via drill 0.35)
  Top 0.203: ER2.1 60.31,35.82 62.97,35.82 65.21,33.57 67.05,33.57 68.88,31.74 68.88,30.92 U$2.TD+ | v49.29,31.02 44.19,31.02 ENC.17
  Bottom 0.203: v49.29,31.02 68.78,31.02 68.88,30.92 U$2.TD+
TD-
  Top 0.203: 56.59,34.34 59.49,31.43 65.72,31.43 66.33,32.04 U$2.TD- | 56.59,34.34 56.02,34.9 56.02,35.82 ER1.1 | 56.59,34.34 52.56,30.31 48.98,30.31 48.88,30.41 44.19,30.41 ENC.16
TXO  (via drill 0.35)
  Top 0.203: v50.92,63.37 55.82,68.27 U1.31
  Bottom 0.203: v50.92,63.37 37.66,50.11 11.53,50.11 PP.3

### Text on the board
tPlace: IOTECH © 2018 | IOTB v0.5 TOP | S/N: | www.iotech.com.tr
bPlace: IOTECH | IOTB BOT